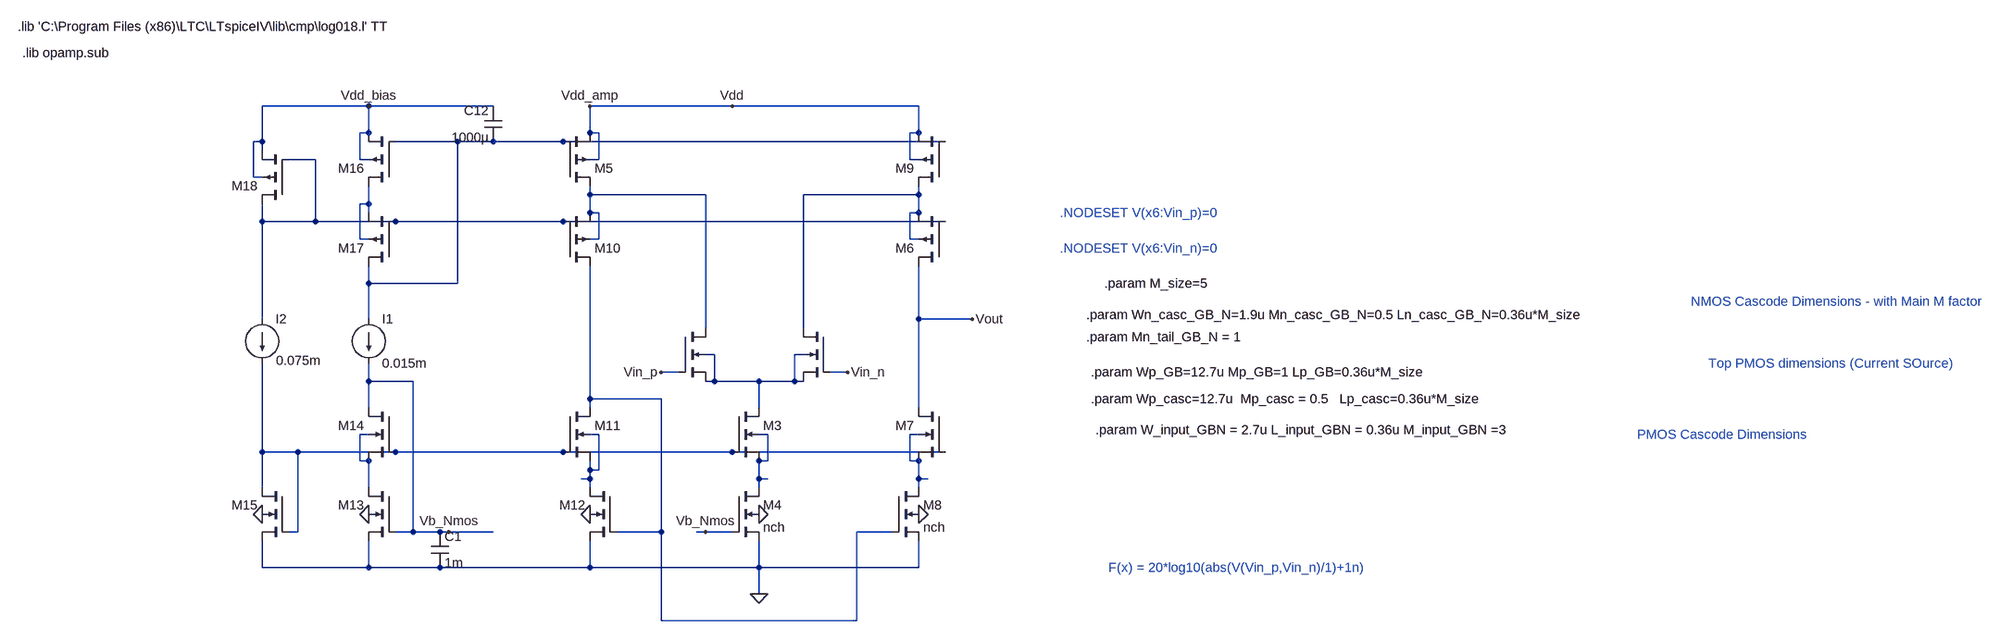
[diagram p0: schematic GB-NMOS.asc]
GB-NMOS.asc, the LTspice schematic file:
Version 4
SHEET 1 3836 784
WIRE 304 -880 240 -880
WIRE 432 -880 304 -880
WIRE 656 -880 432 -880
WIRE 1136 -880 880 -880
WIRE 1376 -880 1136 -880
WIRE 1472 -880 1376 -880
WIRE 432 -832 432 -880
WIRE 432 -832 416 -832
WIRE 880 -832 880 -880
WIRE 896 -832 880 -832
WIRE 1472 -832 1472 -880
WIRE 1472 -832 1456 -832
WIRE 240 -816 240 -880
WIRE 240 -816 224 -816
WIRE 592 -816 480 -816
WIRE 656 -816 592 -816
WIRE 832 -816 656 -816
WIRE 1168 -816 832 -816
WIRE 1520 -816 1168 -816
WIRE 240 -800 240 -816
WIRE 336 -784 288 -784
WIRE 416 -784 416 -832
WIRE 432 -784 416 -784
WIRE 896 -784 896 -832
WIRE 896 -784 880 -784
WIRE 1456 -784 1456 -832
WIRE 1472 -784 1456 -784
WIRE 224 -752 224 -816
WIRE 240 -752 224 -752
WIRE 880 -720 880 -736
WIRE 1008 -720 880 -720
WIRE 1088 -720 1008 -720
WIRE 1360 -720 1264 -720
WIRE 1472 -720 1472 -736
WIRE 1472 -720 1360 -720
WIRE 432 -704 432 -736
WIRE 432 -704 416 -704
WIRE 432 -688 432 -704
WIRE 880 -688 880 -720
WIRE 896 -688 880 -688
WIRE 1472 -688 1472 -720
WIRE 1472 -688 1456 -688
WIRE 240 -672 240 -704
WIRE 336 -672 336 -784
WIRE 336 -672 240 -672
WIRE 480 -672 336 -672
WIRE 736 -672 480 -672
WIRE 832 -672 736 -672
WIRE 1520 -672 832 -672
WIRE 416 -640 416 -704
WIRE 432 -640 416 -640
WIRE 896 -640 896 -688
WIRE 896 -640 880 -640
WIRE 1456 -640 1456 -688
WIRE 1472 -640 1456 -640
WIRE 432 -560 432 -592
WIRE 592 -560 592 -816
WIRE 592 -560 432 -560
WIRE 880 -512 880 -592
WIRE 240 -496 240 -672
WIRE 432 -496 432 -560
WIRE 1472 -496 1472 -592
WIRE 1536 -496 1472 -496
WIRE 1568 -496 1536 -496
WIRE 1088 -480 1088 -720
WIRE 1264 -480 1264 -720
WIRE 1104 -432 1088 -432
WIRE 1264 -432 1248 -432
WIRE 1040 -400 1008 -400
WIRE 1344 -400 1312 -400
WIRE 432 -384 432 -416
WIRE 512 -384 432 -384
WIRE 1104 -384 1104 -432
WIRE 1104 -384 1088 -384
WIRE 1184 -384 1104 -384
WIRE 1248 -384 1248 -432
WIRE 1248 -384 1184 -384
WIRE 1264 -384 1248 -384
WIRE 880 -352 880 -512
WIRE 1008 -352 880 -352
WIRE 432 -336 432 -384
WIRE 880 -336 880 -352
WIRE 1184 -336 1184 -384
WIRE 1472 -336 1472 -496
WIRE 432 -288 416 -288
WIRE 896 -288 880 -288
WIRE 1200 -288 1184 -288
WIRE 1472 -288 1456 -288
WIRE 240 -256 240 -416
WIRE 304 -256 240 -256
WIRE 480 -256 304 -256
WIRE 704 -256 480 -256
WIRE 832 -256 704 -256
WIRE 1136 -256 832 -256
WIRE 1520 -256 1136 -256
WIRE 416 -240 416 -288
WIRE 432 -240 416 -240
WIRE 1200 -240 1200 -288
WIRE 1200 -240 1184 -240
WIRE 1456 -240 1456 -288
WIRE 1472 -240 1456 -240
WIRE 880 -224 880 -240
WIRE 896 -224 896 -288
WIRE 896 -224 880 -224
WIRE 880 -208 880 -224
WIRE 880 -208 864 -208
WIRE 1184 -208 1184 -240
WIRE 1200 -208 1184 -208
WIRE 1472 -208 1472 -240
WIRE 1488 -208 1472 -208
WIRE 240 -192 240 -256
WIRE 432 -192 432 -240
WIRE 880 -192 880 -208
WIRE 1184 -192 1184 -208
WIRE 1472 -192 1472 -208
WIRE 304 -112 304 -256
WIRE 304 -112 288 -112
WIRE 512 -112 512 -384
WIRE 512 -112 480 -112
WIRE 560 -112 512 -112
WIRE 576 -112 560 -112
WIRE 656 -112 576 -112
WIRE 1008 -112 1008 -352
WIRE 1008 -112 928 -112
WIRE 1088 -112 1072 -112
WIRE 1136 -112 1088 -112
WIRE 1424 -112 1360 -112
WIRE 240 -48 240 -96
WIRE 432 -48 432 -96
WIRE 432 -48 240 -48
WIRE 560 -48 432 -48
WIRE 880 -48 880 -96
WIRE 880 -48 560 -48
WIRE 1184 -48 1184 -96
WIRE 1184 -48 880 -48
WIRE 1472 -48 1472 -96
WIRE 1472 -48 1184 -48
WIRE 1184 0 1184 -48
WIRE 1008 48 1008 -112
WIRE 1360 48 1360 -112
WIRE 1360 48 1008 48
FLAG 1184 -144 0
FLAG 1184 0 0
FLAG 880 -144 0
FLAG 880 -880 Vdd_amp
FLAG 432 -144 0
FLAG 240 -144 0
FLAG 1472 -144 0
FLAG 1008 -400 Vin_p
FLAG 1344 -400 Vin_n
FLAG 576 -112 Vb_Nmos
FLAG 1088 -112 Vb_Nmos
FLAG 1568 -496 Vout
FLAG 432 -880 Vdd_bias
FLAG 1136 -880 Vdd
DATAFLAG 1376 -880 "round($*1k)/1k"
DATAFLAG 976 -832 "-Id(x6:x2:M5)"
DATAFLAG 1008 -720 "round($*1000)/1000"
DATAFLAG 864 -208 ""
DATAFLAG 1200 -208 ""
DATAFLAG 1488 -208 ""
DATAFLAG 1360 -720 "round($*1000)/1000"
DATAFLAG 736 -672 "round($*1000)/1000"
DATAFLAG 880 -512 "round($*1000)/1000"
DATAFLAG 1184 -384 "round($*1000)/1000"
DATAFLAG 704 -256 "round($*1000)/1000"
DATAFLAG 656 -112 "round($*1000)/1000"
DATAFLAG 1536 -496 "round($*1000)/1000"
DATAFLAG 1168 -816 ""
DATAFLAG 304 -880 ""
DATAFLAG 1008 -496 "-Id(x6:x1:M1)"
DATAFLAG 800 -400 "-Id(x6:x1:M11)"
SYMBOL nmos4 1040 -480 R0
WINDOW 0 56 32 Invisible 2
WINDOW 3 56 72 Invisible 2
SYMATTR InstName M1
SYMATTR Value nch
SYMATTR Value2 l={L_input_GBN} w={W_input_GBN} m={M_input_GBN}
SYMBOL nmos4 1136 -336 R0
WINDOW 3 56 72 Invisible 2
SYMATTR Value nch
SYMATTR InstName M3
SYMATTR Value2 l={Ln_casc_GB_N} w={Wn_casc_GB_N} m={Mn_tail_GB_N}
SYMBOL nmos4 1136 -192 R0
SYMATTR InstName M4
SYMATTR Value nch
SYMATTR Value2 l={Ln_casc_GB_N} w={Wn_casc_GB_N} m={Mn_tail_GB_N}
SYMBOL nmos4 832 -336 R0
WINDOW 3 56 72 Invisible 2
SYMATTR Value nch
SYMATTR InstName M11
SYMATTR Value2 l={Ln_casc_GB_N} w={Wn_casc_GB_N} m={Mn_casc_GB_N}
SYMBOL nmos4 928 -192 M0
WINDOW 3 56 72 Invisible 2
SYMATTR Value nch
SYMATTR InstName M12
SYMATTR Value2 l={Ln_casc_GB_N} w={Wn_casc_GB_N} m={Mn_casc_GB_N}
SYMBOL nmos4 480 -192 M0
WINDOW 3 56 72 Invisible 2
SYMATTR Value nch
SYMATTR InstName M13
SYMATTR Value2 l={Ln_casc_GB_N} w={Wn_casc_GB_N} m={Mn_tail_GB_N}
SYMBOL current 432 -496 R0
WINDOW 123 0 0 Left 2
WINDOW 39 0 0 Left 2
SYMATTR InstName I1
SYMATTR Value 0.015m
SYMBOL nmos4 480 -336 M0
WINDOW 3 56 72 Invisible 2
SYMATTR Value nch
SYMATTR InstName M14
SYMATTR Value2 l={Ln_casc_GB_N} w={Wn_casc_GB_N} m={Mn_tail_GB_N}
SYMBOL current 240 -496 R0
WINDOW 123 0 0 Left 2
WINDOW 39 0 0 Left 2
WINDOW 3 25 75 Left 2
SYMATTR Value 0.075m
SYMATTR InstName I2
SYMBOL nmos4 288 -192 M0
WINDOW 3 56 72 Invisible 2
SYMATTR Value nch
SYMATTR InstName M15
SYMATTR Value2 l={Ln_casc_GB_N} w={Wn_casc_GB_N} m={Mn_tail_GB_N}
SYMBOL nmos4 1312 -480 M0
WINDOW 0 56 32 Invisible 2
WINDOW 3 56 72 Invisible 2
SYMATTR InstName M2
SYMATTR Value nch
SYMATTR Value2 l={L_input_GBN} w={W_input_GBN} m={M_input_GBN}
SYMBOL pmos4 1520 -592 R180
WINDOW 3 56 72 Invisible 2
SYMATTR Value pch
SYMATTR InstName M6
SYMATTR Value2 l={Lp_casc} w={Wp_casc} m={Mp_casc}
SYMBOL nmos4 1520 -336 M0
WINDOW 3 56 72 Invisible 2
SYMATTR Value nch
SYMATTR InstName M7
SYMATTR Value2 l={Ln_casc_GB_N} w={Wn_Casc_GB_N} m={Mn_casc_GB_N}
SYMBOL nmos4 1424 -192 R0
SYMATTR InstName M8
SYMATTR Value nch
SYMATTR Value2 l={Ln_casc_GB_N} w={Wn_Casc_GB_N} m={Mn_casc_GB_N}
SYMBOL pmos4 1520 -736 R180
WINDOW 3 56 72 Invisible 2
SYMATTR Value pch
SYMATTR InstName M9
SYMATTR Value2 l={Lp_GB} w={Wp_GB} m={Mp_GB}
SYMBOL cap 672 -816 R180
WINDOW 0 24 56 Left 2
WINDOW 3 24 8 Left 2
SYMATTR InstName C12
SYMATTR Value 1000µ
SYMBOL cap 544 -112 R0
SYMATTR InstName C1
SYMATTR Value 1m
SYMBOL pmos4 832 -736 M180
WINDOW 3 56 72 Invisible 2
SYMATTR Value pch
SYMATTR InstName M5
SYMATTR Value2 l={Lp_GB} w={Wp_GB} m={Mp_GB}
SYMBOL pmos4 480 -736 R180
WINDOW 3 56 72 Invisible 2
SYMATTR Value pch
SYMATTR InstName M16
SYMATTR Value2 l={Lp_GB} w={Wp_GB} m={Mp_GB}
SYMBOL pmos4 288 -704 R180
WINDOW 3 56 72 Invisible 2
SYMATTR Value pch
SYMATTR InstName M18
SYMATTR Value2 l={Lp_GB} w={Wp_GB} m={Mp_GB}
SYMBOL pmos4 832 -592 M180
WINDOW 3 56 72 Invisible 2
SYMATTR Value pch
SYMATTR InstName M10
SYMATTR Value2 l={Lp_casc} w={Wp_casc} m={Mp_casc}
SYMBOL pmos4 480 -592 R180
WINDOW 3 56 72 Invisible 2
SYMATTR Value pch
SYMATTR InstName M17
SYMATTR Value2 l={Lp_casc} w={Wp_casc} m={Mp_casc}
TEXT -200 -1024 Left 2 !.lib 'C:\\Program Files (x86)\\LTC\\LTspiceIV\\lib\\cmp\\log018.l' TT
TEXT -192 -976 Left 2 !.lib opamp.sub
TEXT 1872 -504 Left 2 !.param Wn_casc_GB_N=1.9u Mn_casc_GB_N=0.5 Ln_casc_GB_N=0.36u*M_size
TEXT 1880 -400 Left 2 !.param Wp_GB=12.7u Mp_GB=1 Lp_GB=0.36u*M_size
TEXT 1912 -48 Left 2 ;F(x) = 20*log10(abs(V(Vin_p,Vin_n)/1)+1n)
TEXT 3240 -416 Left 2 ;Top PMOS dimensions (Current SOurce)
TEXT 3112 -288 Left 2 ;PMOS Cascode Dimensions
TEXT 3208 -528 Left 2 ;NMOS Cascode Dimensions - with Main M factor
TEXT 1888 -296 Left 2 !.param W_input_GBN = 2.7u L_input_GBN = 0.36u M_input_GBN =3
TEXT 1824 -688 Left 2 ;.NODESET V(x6:Vin_p)=0
TEXT 1824 -624 Left 2 ;.NODESET V(x6:Vin_n)=0
TEXT 1872 -464 Left 2 !.param Mn_tail_GB_N = 1
TEXT 1904 -560 Left 2 !.param M_size=5
TEXT 1880 -352 Left 2 !.param Wp_casc=12.7u  Mp_casc = 0.5   Lp_casc=0.36u*M_size

The netlist it stands for:
* GB-NMOS.asc
M1 N003 Vin_p N007 N007 nch l={L_input_GBN} w={W_input_GBN} m={M_input_GBN}
M3 N007 N012 N010 N010 nch l={Ln_casc_GB_N} w={Wn_casc_GB_N} m={Mn_tail_GB_N}
M4 N010 Vb_Nmos 0 0 nch l={Ln_casc_GB_N} w={Wn_casc_GB_N} m={Mn_tail_GB_N}
M11 N006 N012 N009 N009 nch l={Ln_casc_GB_N} w={Wn_casc_GB_N} m={Mn_casc_GB_N}
M12 N009 N006 0 0 nch l={Ln_casc_GB_N} w={Wn_casc_GB_N} m={Mn_casc_GB_N}
M13 N008 Vb_Nmos 0 0 nch l={Ln_casc_GB_N} w={Wn_casc_GB_N} m={Mn_tail_GB_N}
I1 N001 Vb_Nmos 0.015m
M14 Vb_Nmos N012 N008 N008 nch l={Ln_casc_GB_N} w={Wn_casc_GB_N} m={Mn_tail_GB_N}
I2 N002 N012 0.075m
M15 N012 N012 0 0 nch l={Ln_casc_GB_N} w={Wn_casc_GB_N} m={Mn_tail_GB_N}
M2 N004 Vin_n N007 N007 nch l={L_input_GBN} w={W_input_GBN} m={M_input_GBN}
M6 Vout N002 N004 N004 pch l={Lp_casc} w={Wp_casc} m={Mp_casc}
M7 Vout N012 N011 N011 nch l={Ln_casc_GB_N} w={Wn_Casc_GB_N} m={Mn_casc_GB_N}
M8 N011 N006 0 0 nch l={Ln_casc_GB_N} w={Wn_Casc_GB_N} m={Mn_casc_GB_N}
M9 N004 N001 Vdd Vdd pch l={Lp_GB} w={Wp_GB} m={Mp_GB}
C12 N001 Vdd_bias 1000µ
C1 Vb_Nmos 0 1m
M5 N003 N001 Vdd Vdd pch l={Lp_GB} w={Wp_GB} m={Mp_GB}
M16 N005 N001 Vdd_bias Vdd_bias pch l={Lp_GB} w={Wp_GB} m={Mp_GB}
M18 N002 N002 Vdd_bias Vdd_bias pch l={Lp_GB} w={Wp_GB} m={Mp_GB}
M10 N006 N002 N003 N003 pch l={Lp_casc} w={Wp_casc} m={Mp_casc}
M17 N001 N002 N005 N005 pch l={Lp_casc} w={Wp_casc} m={Mp_casc}
.model NMOS NMOS
.model PMOS PMOS
.lib standard.mos
.lib 'C:\Program Files (x86)\LTC\LTspiceIV\lib\cmp\log018.l' TT
.lib opamp.sub
.param Wn_casc_GB_N=1.9u Mn_casc_GB_N=0.5 Ln_casc_GB_N=0.36u*M_size
.param Wp_GB=12.7u Mp_GB=1 Lp_GB=0.36u*M_size
* F(x) = 20*log10(abs(V(Vin_p,Vin_n)/1)+1n)
* Top PMOS dimensions (Current SOurce)
* PMOS Cascode Dimensions
* NMOS Cascode Dimensions - with Main M factor
.param W_input_GBN = 2.7u L_input_GBN = 0.36u M_input_GBN =3
* .NODESET V(x6:Vin_p)=0
* .NODESET V(x6:Vin_n)=0
.param Mn_tail_GB_N = 1
.param M_size=5
.param Wp_casc=12.7u  Mp_casc = 0.5   Lp_casc=0.36u*M_size
.backanno
.end